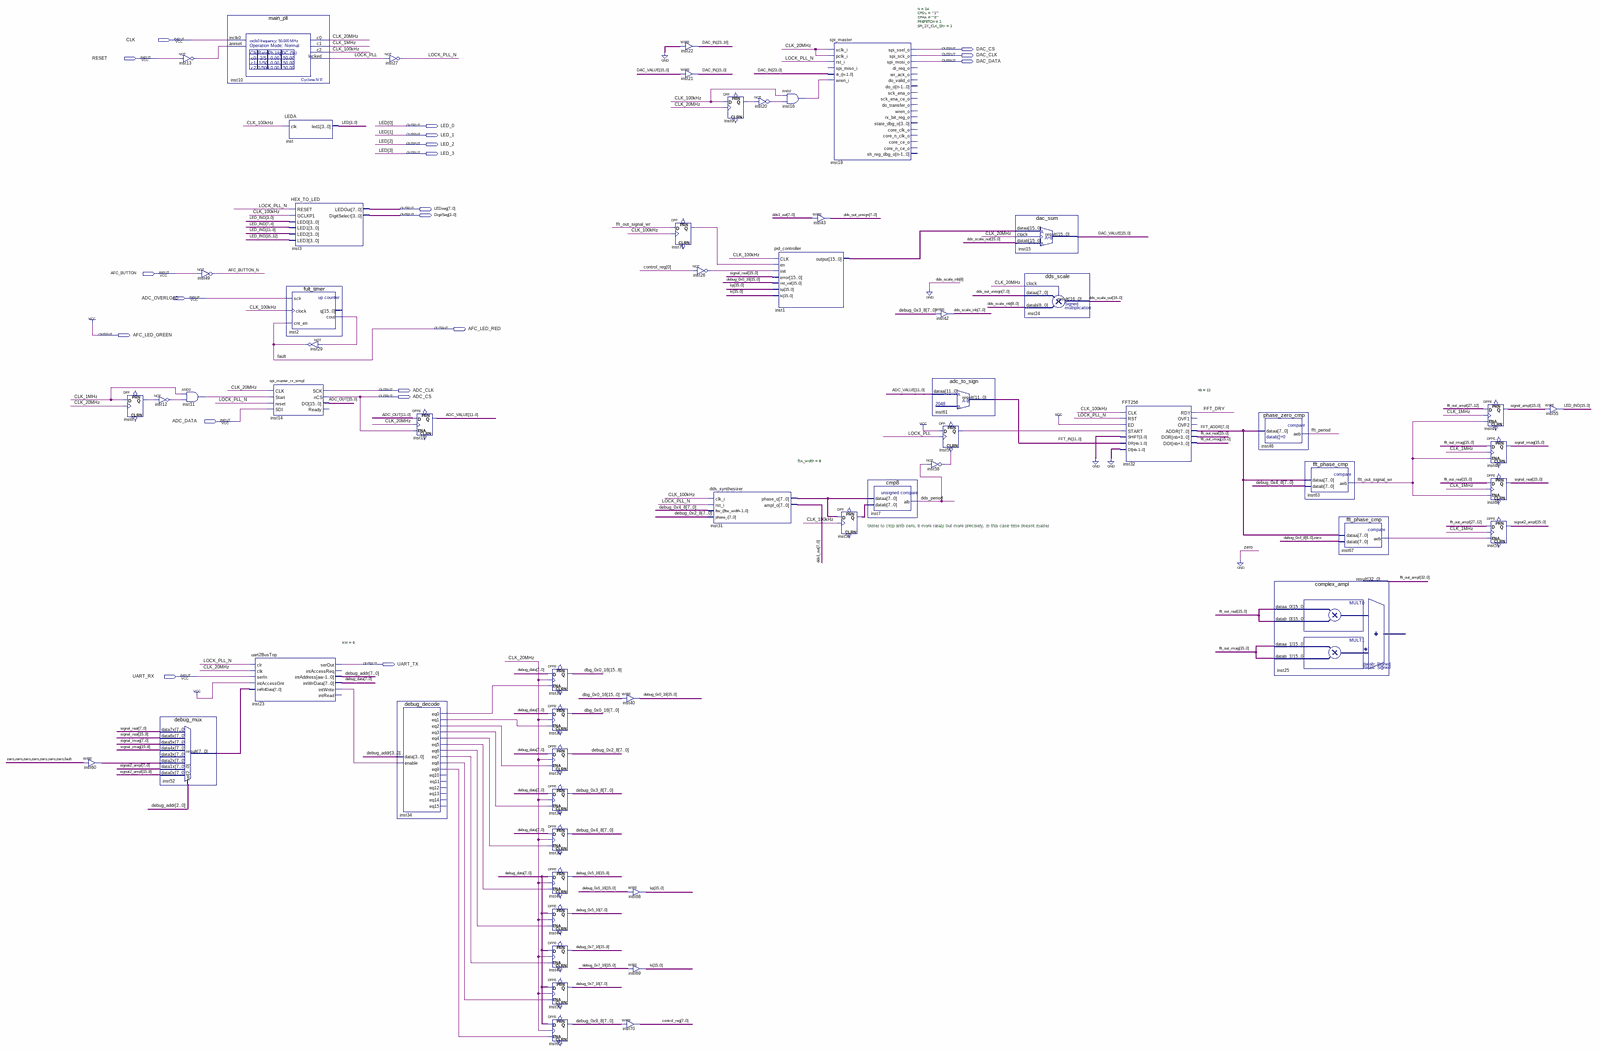
[diagram p0: schematic sheet, whole]
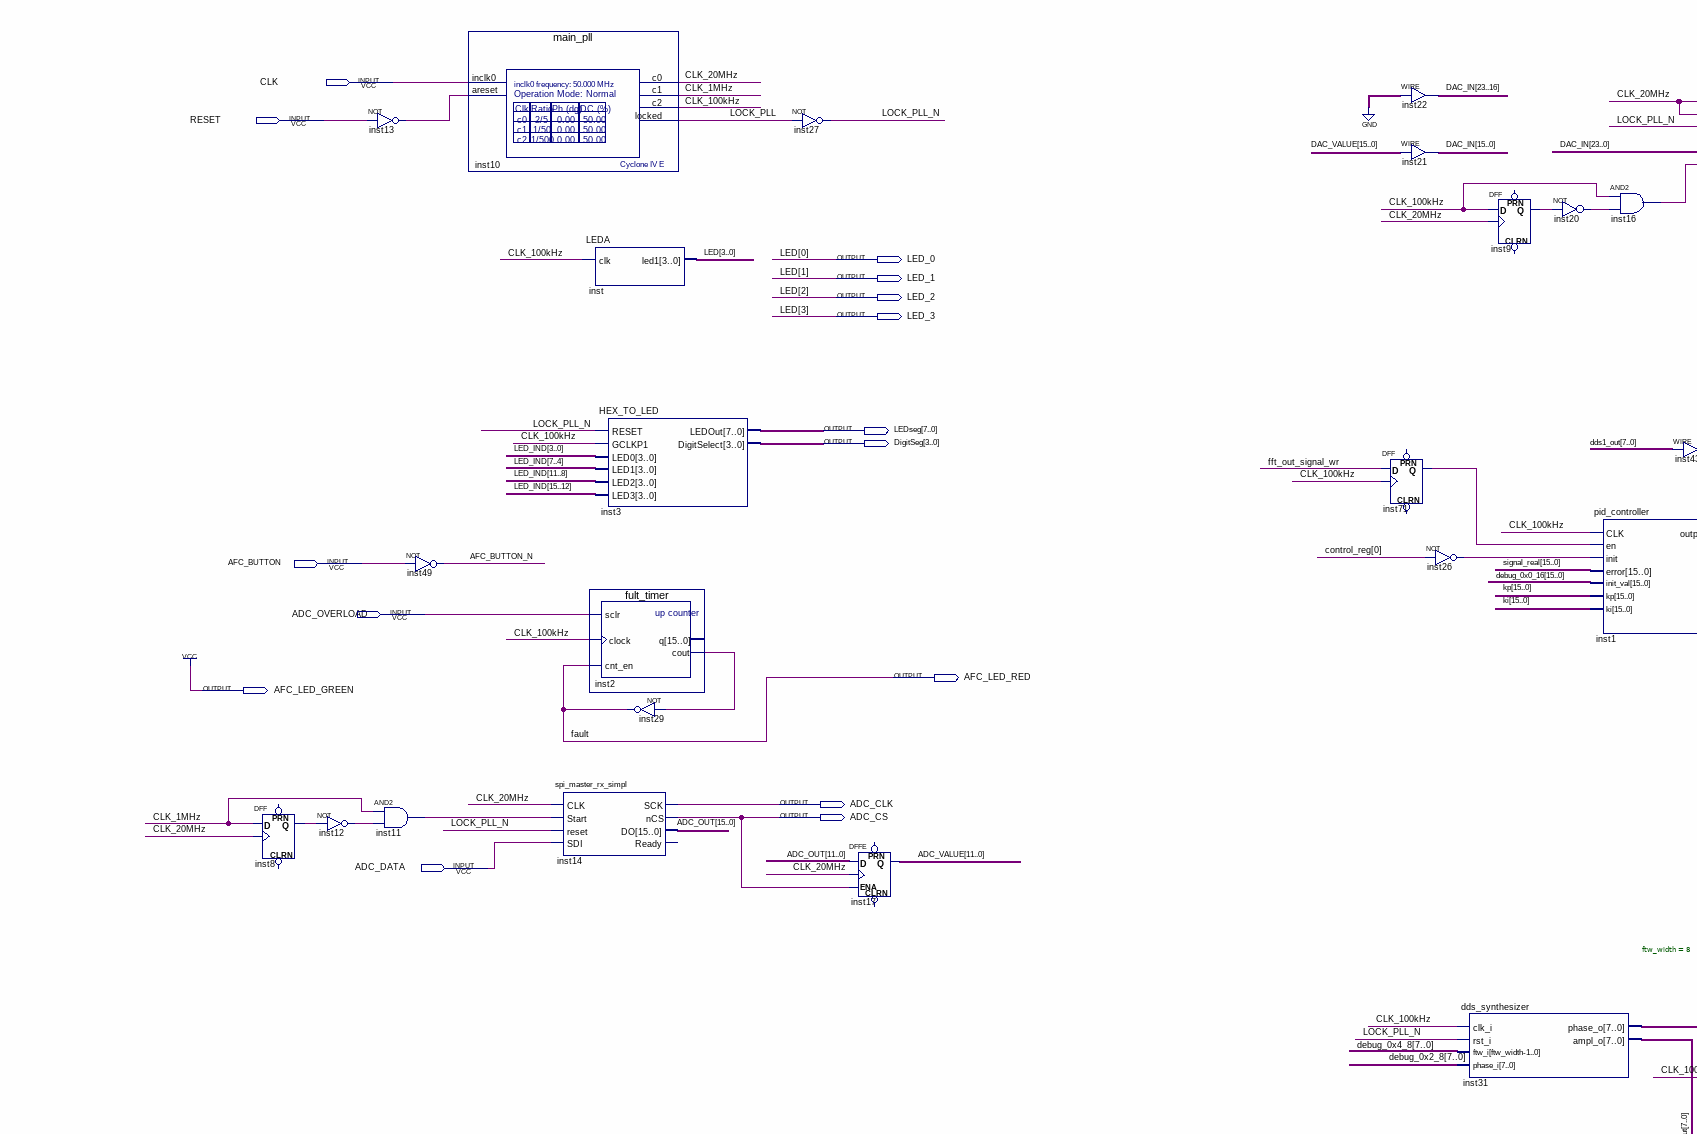
[diagram p1: schematic sheet, upper left part]
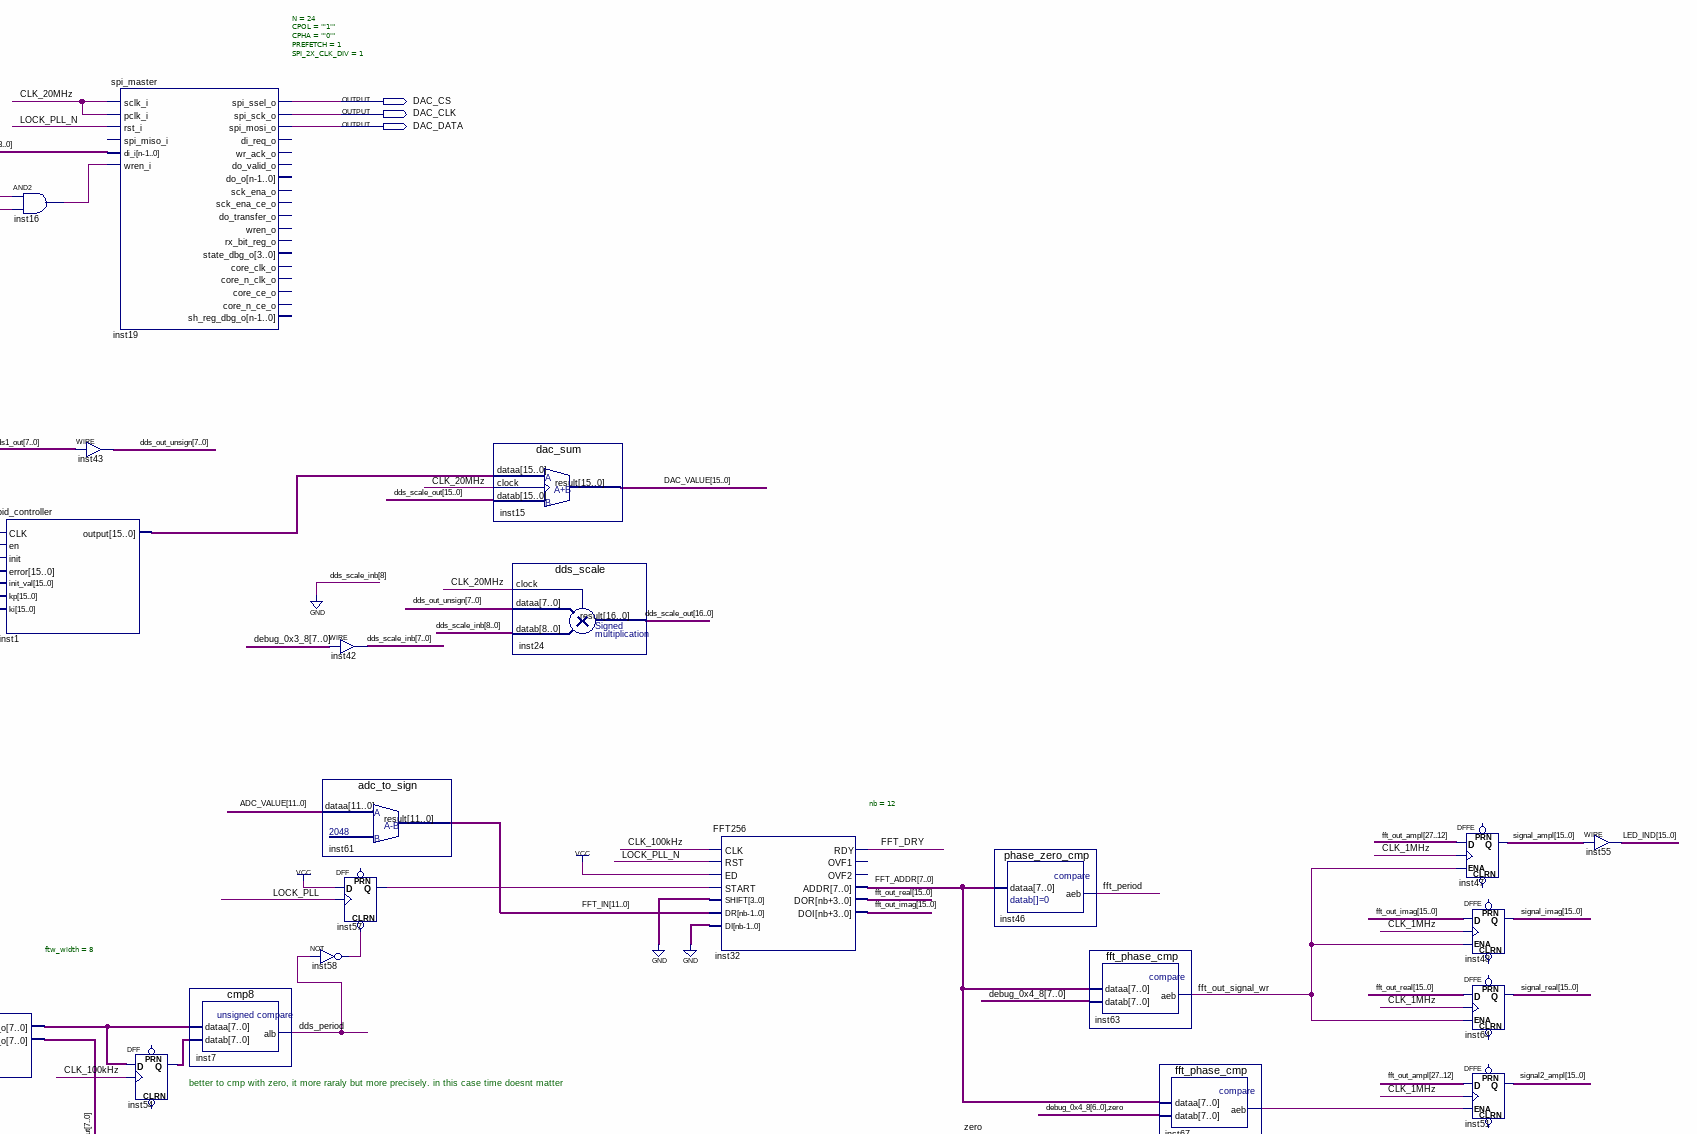
[diagram p2: schematic sheet, upper right part]
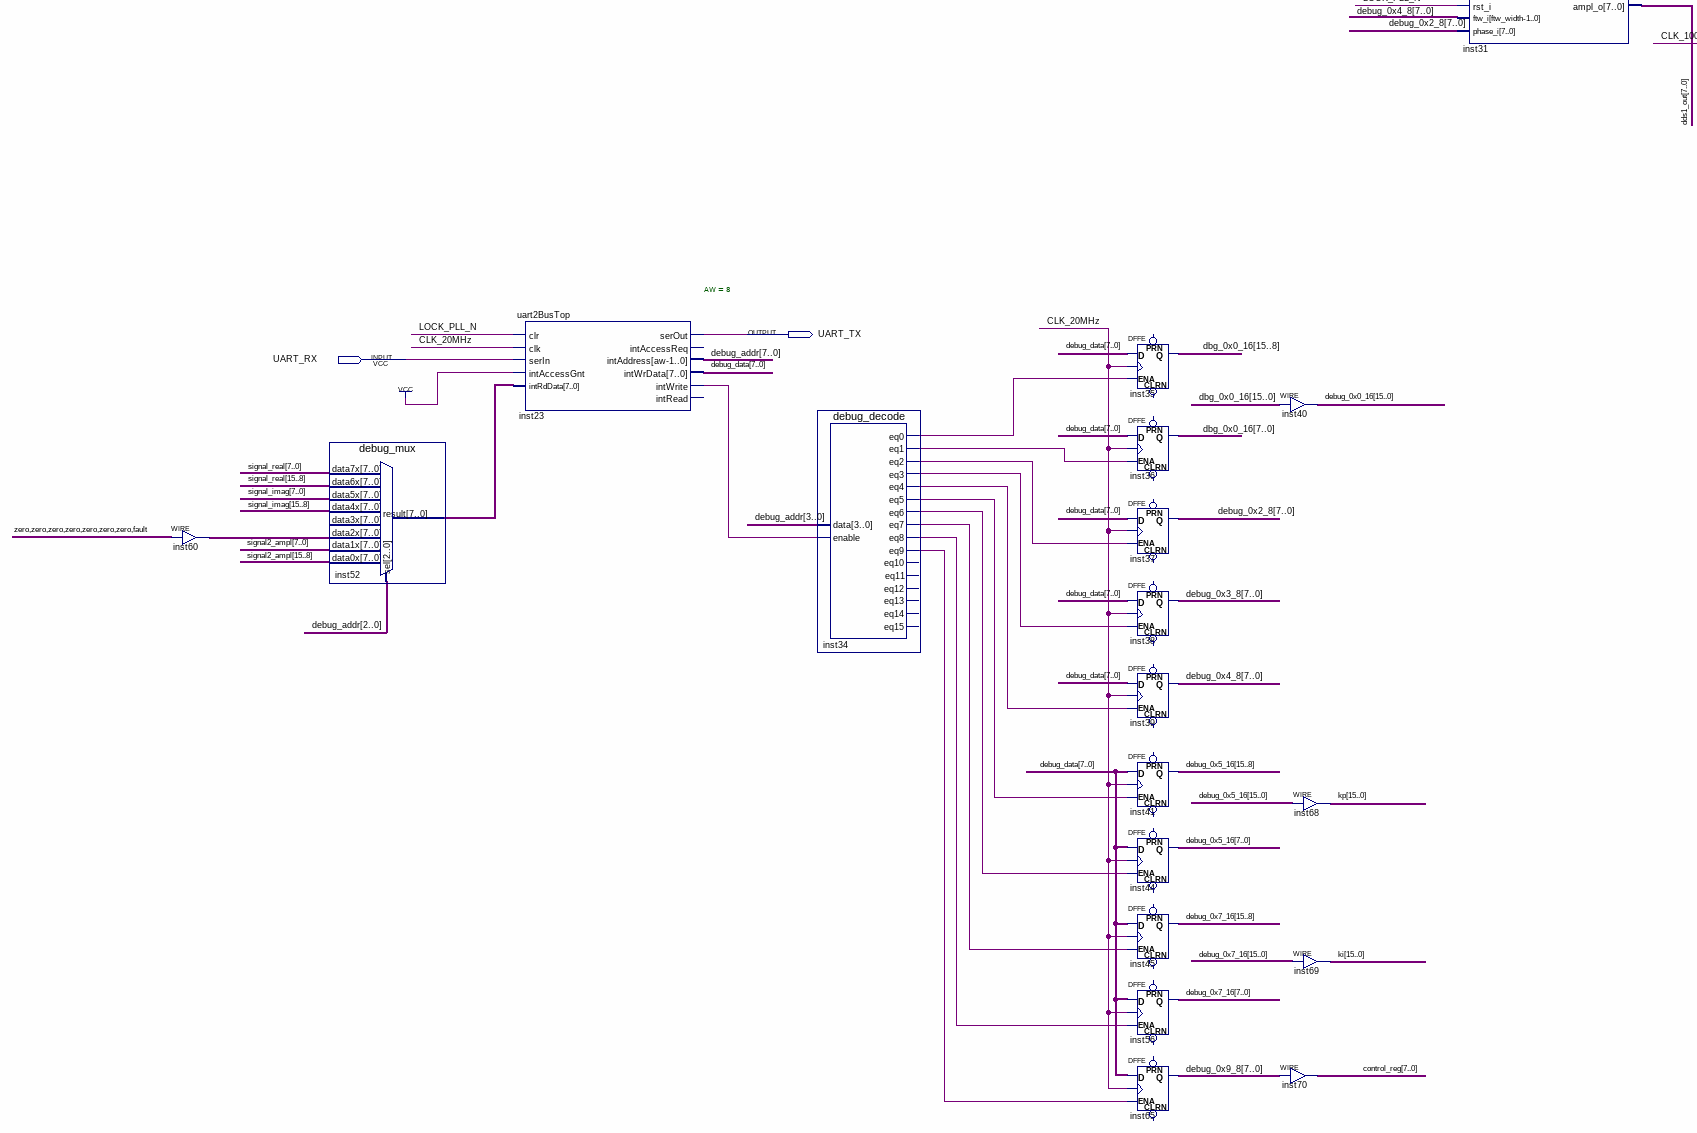
[diagram p3: schematic sheet, lower left part]
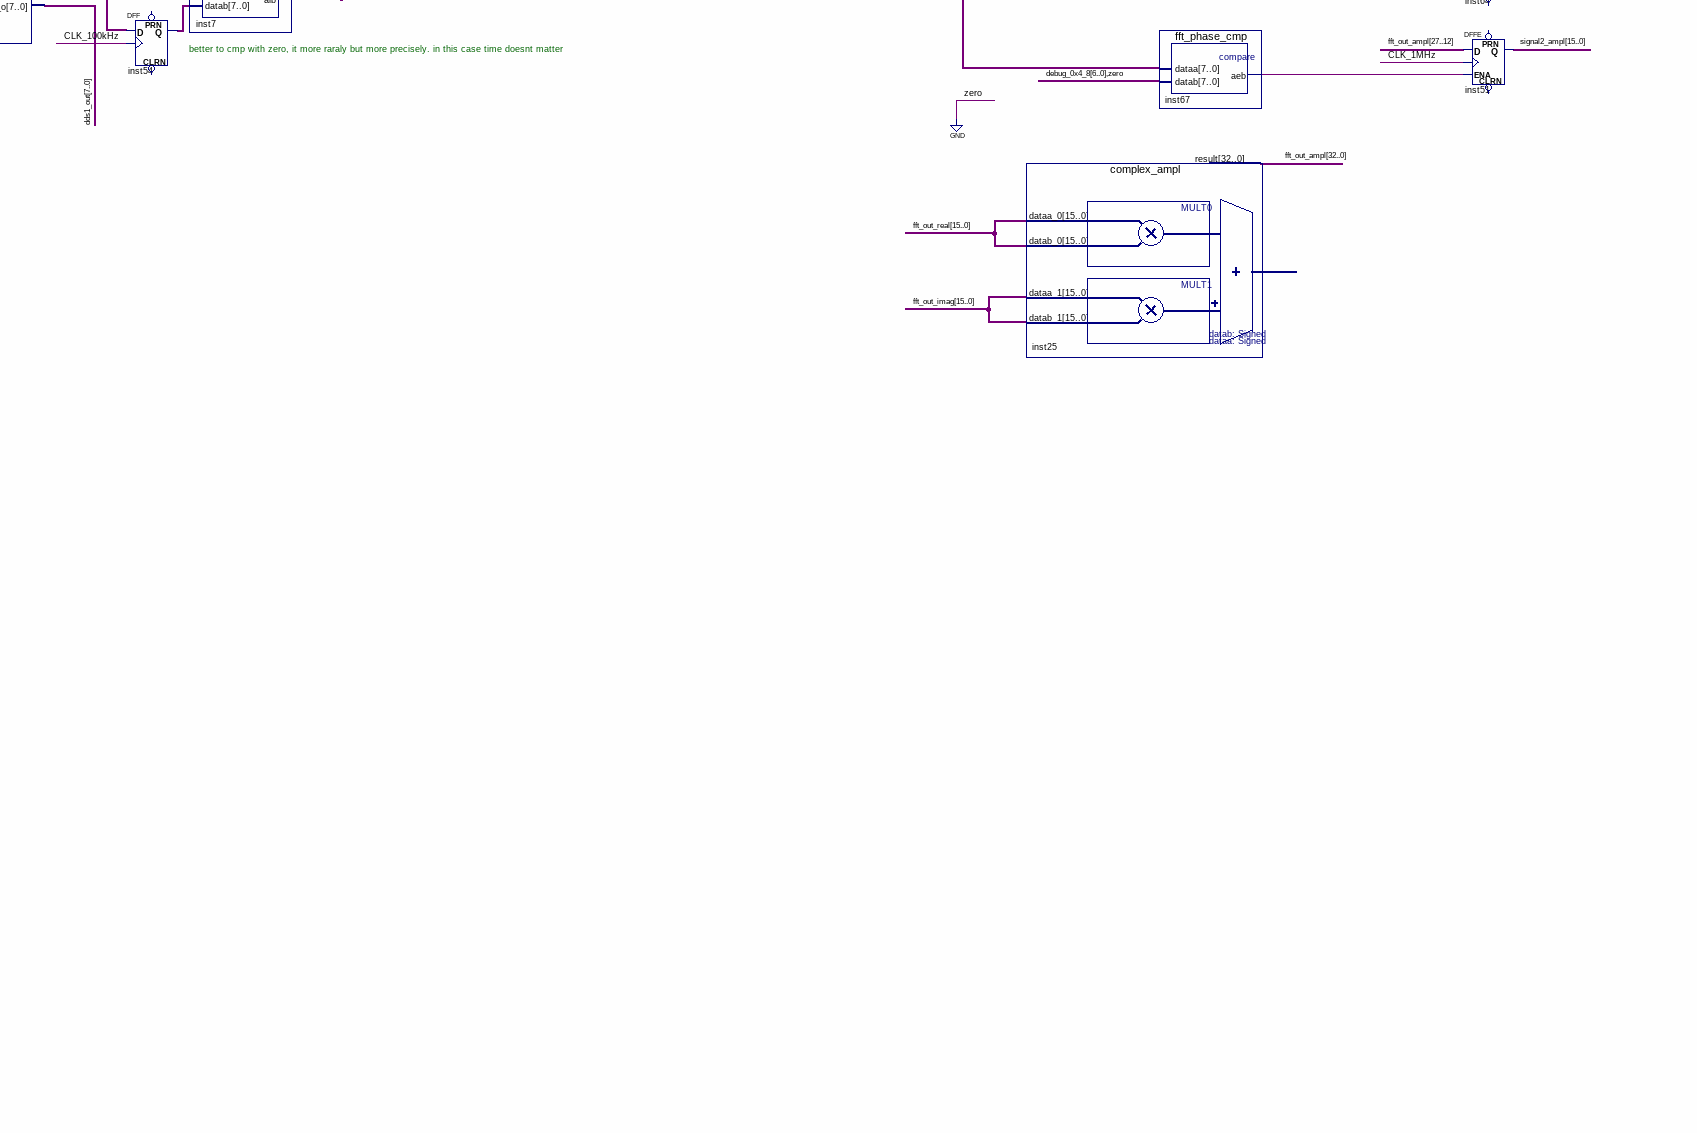
[diagram p4: schematic sheet, lower right part]
// Quartus schematic main.bdf as structural Verilog: 60 symbols, 20 pins
module main (
  input  CLK,
  input  RESET,
  input  AFC_BUTTON,
  input  ADC_OVERLOAD,
  input  ADC_DATA,
  input  UART_RX,
  output DAC_CS,
  output DAC_CLK,
  output DAC_DATA,
  output LED_0,
  output LED_1,
  output LED_2,
  output LED_3,
  output [7:0] LEDseg,
  output [3:0] DigitSeg,
  output AFC_LED_RED,
  output AFC_LED_GREEN,
  output ADC_CLK,
  output ADC_CS,
  output UART_TX
);

  wire AFC_BUTTON_N, CLK_1MHz, CLK_20MHz, CLK_100kHz, dds_period, FFT_DRY, fft_out_signal_wr, fft_period,
       inst2_cout, inst8_q, inst9_q, inst11_out, inst12_out, inst13_out, inst16_out, inst20_out,
       inst23_intwrite, inst26_out, inst34_eq0, inst34_eq1, inst34_eq2, inst34_eq3, inst34_eq4, inst34_eq5,
       inst34_eq6, inst34_eq7, inst34_eq8, inst34_eq9, inst57_q, inst58_out, inst67_aeb, inst71_q, LOCK_PLL,
       LOCK_PLL_N;
  wire [7:0] control_reg, dds1_out, dds_out_unsign, dds_scale_inb, debug_0x2_8, debug_0x3_8, debug_0x4_8,
       debug_0x9_8, debug_addr, debug_data, FFT_ADDR, inst31_phase_o, inst52_result, inst54_q, inst60_out;
  wire [11:0] ADC_VALUE, FFT_IN;
  wire [15:0] ADC_OUT, DAC_VALUE, dbg_0x0_16, debug_0x0_16, debug_0x5_16, debug_0x7_16, fft_out_imag,
       fft_out_real, inst1_output, ki, kp, LED_IND, signal2_ampl, signal_ampl, signal_imag, signal_real;
  wire [16:0] dds_scale_out;
  wire [23:0] DAC_IN;
  wire [32:0] fft_out_ampl;

  assign inst60_out = {{7{1'b0}}, AFC_LED_RED};  // WIRE inst60
  DFF inst8 (.CLK(CLK_20MHz), .D(CLK_1MHz), .Q(inst8_q));  // open: CLRN, PRN
  not inst12 (inst12_out, inst8_q);
  debug_mux inst52 (
    .data7x(signal_real[7:0]), .data6x(signal_real[15:8]), .data5x(signal_imag[7:0]),
    .data4x(signal_imag[15:8]), .data2x(inst60_out), .data1x(signal2_ampl[7:0]), .data0x(signal2_ampl[15:8]),
    .sel(debug_addr[2:0]), .result(inst52_result));  // open: data3x
  not inst13 (inst13_out, RESET);
  and inst11 (inst11_out, CLK_1MHz, inst12_out);
  not inst49 (AFC_BUTTON_N, AFC_BUTTON);
  main_pll inst10 (
    .inclk0(CLK), .areset(inst13_out), .c0(CLK_20MHz), .c1(CLK_1MHz), .c2(CLK_100kHz), .locked(LOCK_PLL));
  uart2BusTop #(.AW(8)) inst23 (
    .clr(LOCK_PLL_N), .clk(CLK_20MHz), .serIn(UART_RX), .intAccessGnt(1'b1), .intRdData(inst52_result),
    .serOut(UART_TX), .intAddress(debug_addr), .intWrData(debug_data), .intWrite(inst23_intwrite));  // open: intAccessReq, intRead
  LEDA inst (.clk(CLK_100kHz), .led1({LED_3, LED_2, LED_1, LED_0}));
  spi_master_rx_simpl inst14 (
    .CLK(CLK_20MHz), .Start(inst11_out), .reset(LOCK_PLL_N), .SDI(ADC_DATA), .SCK(ADC_CLK), .nCS(ADC_CS),
    .DO(ADC_OUT));  // open: Ready
  HEX_TO_LED inst3 (
    .RESET(LOCK_PLL_N), .GCLKP1(CLK_100kHz), .LED0(LED_IND[3:0]), .LED1(LED_IND[7:4]), .LED2(LED_IND[11:8]),
    .LED3(LED_IND[15:12]), .LEDOut(LEDseg), .DigitSelect(DigitSeg));
  fult_timer inst2 (.sclr(ADC_OVERLOAD), .clock(CLK_100kHz), .cnt_en(AFC_LED_RED), .cout(inst2_cout));  // open: q
  not inst29 (AFC_LED_RED, inst2_cout);
  not inst27 (LOCK_PLL_N, LOCK_PLL);
  debug_decode inst34 (
    .data(debug_addr[3:0]), .enable(inst23_intwrite), .eq0(inst34_eq0), .eq1(inst34_eq1), .eq2(inst34_eq2),
    .eq3(inst34_eq3), .eq4(inst34_eq4), .eq5(inst34_eq5), .eq6(inst34_eq6), .eq7(inst34_eq7),
    .eq8(inst34_eq8), .eq9(inst34_eq9));  // open: eq10, eq11, eq12, eq13, eq14, eq15
  DFFE inst17[11:0] (.D(ADC_OUT[11:0]), .CLK(CLK_20MHz), .ENA(ADC_CS), .Q(ADC_VALUE));  // open: PRN, CLRN
  DFFE inst35[7:0] (.D(debug_data), .CLK(CLK_20MHz), .ENA(inst34_eq0), .Q(dbg_0x0_16[15:8]));  // open: PRN, CLRN
  DFFE inst36[7:0] (.D(debug_data), .CLK(CLK_20MHz), .ENA(inst34_eq1), .Q(dbg_0x0_16[7:0]));  // open: PRN, CLRN
  DFFE inst37[7:0] (.D(debug_data), .CLK(CLK_20MHz), .ENA(inst34_eq2), .Q(debug_0x2_8));  // open: PRN, CLRN
  DFFE inst38[7:0] (.D(debug_data), .CLK(CLK_20MHz), .ENA(inst34_eq3), .Q(debug_0x3_8));  // open: PRN, CLRN
  DFFE inst39[7:0] (.D(debug_data), .CLK(CLK_20MHz), .ENA(inst34_eq4), .Q(debug_0x4_8));  // open: PRN, CLRN
  DFFE inst41[7:0] (.D(debug_data), .CLK(CLK_20MHz), .ENA(inst34_eq5), .Q(debug_0x5_16[15:8]));  // open: PRN, CLRN
  DFFE inst44[7:0] (.D(debug_data), .CLK(CLK_20MHz), .ENA(inst34_eq6), .Q(debug_0x5_16[7:0]));  // open: PRN, CLRN
  DFFE inst45[7:0] (.D(debug_data), .CLK(CLK_20MHz), .ENA(inst34_eq7), .Q(debug_0x7_16[15:8]));  // open: PRN, CLRN
  DFFE inst56[7:0] (.D(debug_data), .CLK(CLK_20MHz), .ENA(inst34_eq8), .Q(debug_0x7_16[7:0]));  // open: PRN, CLRN
  DFFE inst65[7:0] (.D(debug_data), .CLK(CLK_20MHz), .ENA(inst34_eq9), .Q(debug_0x9_8));  // open: PRN, CLRN
  assign debug_0x0_16 = dbg_0x0_16;  // WIRE inst40
  assign kp = debug_0x5_16;  // WIRE inst68
  assign ki = debug_0x7_16;  // WIRE inst69
  assign control_reg = debug_0x9_8;  // WIRE inst70
  DFF inst71 (.CLK(CLK_100kHz), .D(fft_out_signal_wr), .Q(inst71_q));  // open: CLRN, PRN
  assign DAC_IN[23:16] = {8{1'b0}};  // WIRE inst22
  assign DAC_IN[15:0] = DAC_VALUE;  // WIRE inst21
  not inst26 (inst26_out, control_reg[0]);
  DFF inst9 (.CLK(CLK_20MHz), .D(CLK_100kHz), .Q(inst9_q));  // open: CLRN, PRN
  dds_synthesizer #(.ftw_width(8)) inst31 (
    .clk_i(CLK_100kHz), .rst_i(LOCK_PLL_N), .ftw_i(debug_0x4_8), .phase_i(debug_0x2_8),
    .phase_o(inst31_phase_o), .ampl_o(dds1_out));
  not inst20 (inst20_out, inst9_q);
  pid_controller inst1 (
    .CLK(CLK_100kHz), .en(inst71_q), .init(inst26_out), .error(signal_real), .init_val(debug_0x0_16),
    .kp(kp), .ki(ki), .\output (inst1_output));
  and inst16 (inst16_out, CLK_100kHz, inst20_out);
  assign dds_out_unsign = dds1_out;  // WIRE inst43
  spi_master #(.N(24), .CPOL("'1'"), .CPHA("'0'"), .PREFETCH(1), .SPI_2X_CLK_DIV(1)) inst19 (
    .sclk_i(CLK_20MHz), .pclk_i(CLK_20MHz), .rst_i(LOCK_PLL_N), .di_i(DAC_IN), .wren_i(inst16_out),
    .spi_ssel_o(DAC_CS), .spi_sck_o(DAC_CLK), .spi_mosi_o(DAC_DATA));  // open: spi_miso_i, di_req_o, wr_ack_o, do_valid_o, do_o, sck_ena_o, sck_ena_ce_o, do_transfer_o, wren_o, rx_bit_reg_o, state_dbg_o, core_clk_o, core_n_clk_o, core_ce_o, core_n_ce_o, sh_reg_dbg_o
  DFF inst54[7:0] (.CLK(CLK_100kHz), .D(inst31_phase_o), .Q(inst54_q));  // open: CLRN, PRN
  cmp8 inst7 (.dataa(inst31_phase_o), .datab(inst54_q), .alb(dds_period));
  assign dds_scale_inb = debug_0x3_8;  // WIRE inst42
  adc_to_sign inst61 (.dataa(ADC_VALUE), .result(FFT_IN));
  DFF inst57 (.CLRN(inst58_out), .CLK(LOCK_PLL), .D(1'b1), .Q(inst57_q));  // open: PRN
  not inst58 (inst58_out, dds_period);
  dac_sum inst15 (.dataa(inst1_output), .datab(dds_scale_out[15:0]), .clock(CLK_20MHz), .result(DAC_VALUE));
  dds_scale inst24 (.clock(CLK_20MHz), .dataa(dds_out_unsign), .datab({1'b0, dds_scale_inb}), .result(dds_scale_out));
  FFT256 #(.nb(12)) inst32 (
    .CLK(CLK_100kHz), .RST(LOCK_PLL_N), .ED(1'b1), .START(inst57_q), .SHIFT(4'b0000), .DR(FFT_IN),
    .DI({12{1'b0}}), .RDY(FFT_DRY), .ADDR(FFT_ADDR), .DOR(fft_out_real), .DOI(fft_out_imag));  // open: OVF1, OVF2
  phase_zero_cmp inst46 (.dataa(FFT_ADDR), .aeb(fft_period));
  complex_ampl inst25 (
    .dataa_0(fft_out_real), .datab_0(fft_out_real), .dataa_1(fft_out_imag), .datab_1(fft_out_imag),
    .result(fft_out_ampl));
  fft_phase_cmp inst63 (.dataa(FFT_ADDR), .datab(debug_0x4_8), .aeb(fft_out_signal_wr));
  fft_phase_cmp inst67 (.dataa(FFT_ADDR), .datab({debug_0x4_8[6:0], 1'b0}), .aeb(inst67_aeb));
  DFFE inst47[15:0] (
    .D(fft_out_ampl[27:12]), .CLK(CLK_1MHz), .ENA(fft_out_signal_wr), .Q(signal_ampl));  // open: PRN, CLRN
  DFFE inst48[15:0] (.D(fft_out_imag), .CLK(CLK_1MHz), .ENA(fft_out_signal_wr), .Q(signal_imag));  // open: PRN, CLRN
  DFFE inst64[15:0] (.D(fft_out_real), .CLK(CLK_1MHz), .ENA(fft_out_signal_wr), .Q(signal_real));  // open: PRN, CLRN
  DFFE inst51[15:0] (.D(fft_out_ampl[27:12]), .CLK(CLK_1MHz), .ENA(inst67_aeb), .Q(signal2_ampl));  // open: PRN, CLRN
  assign LED_IND = signal_ampl;  // WIRE inst55

  assign AFC_LED_GREEN = 1'b1;

  // Other names for the same wires on the sheet: fault = AFC_LED_RED; LED[3:0] = {LED_3, LED_2, LED_1, LED_0}

  // Notes on the sheet:
  //   better to cmp with zero, it more raraly but more precisely. in this case time doesnt matter
endmodule
